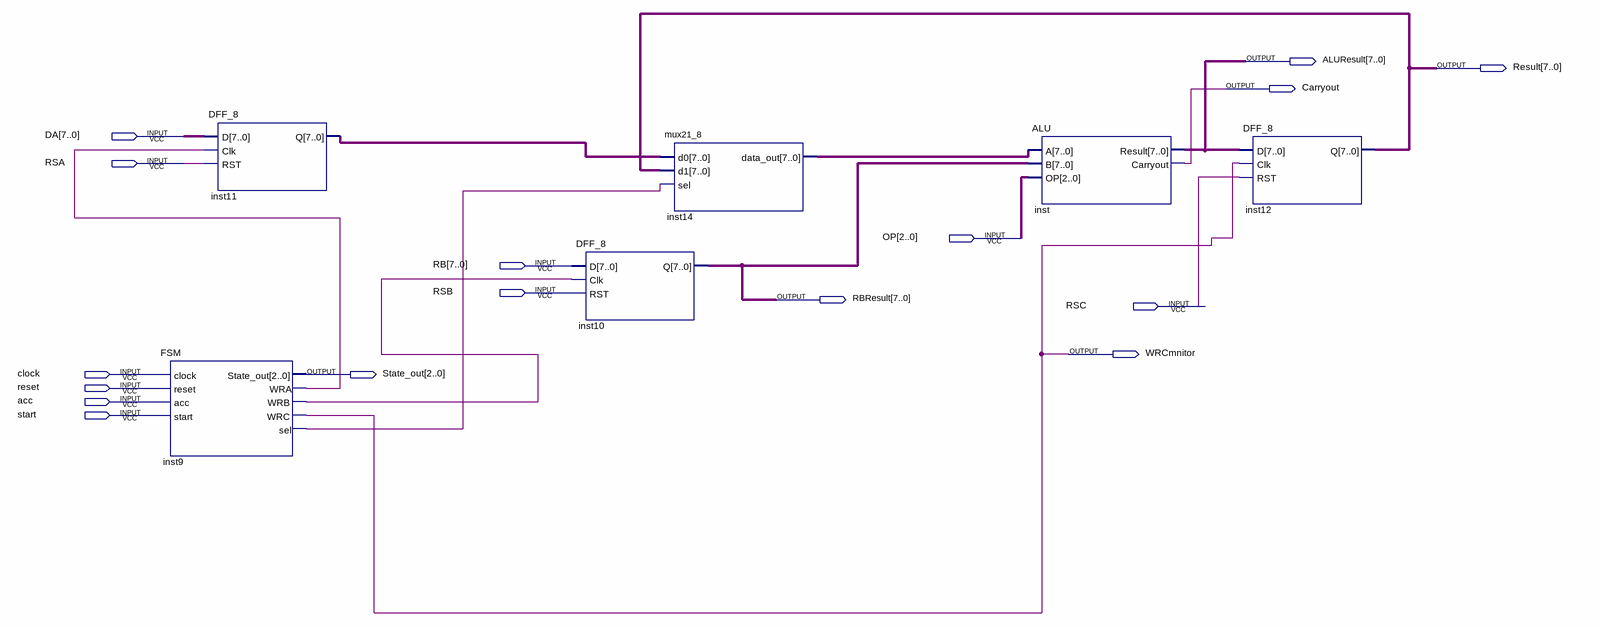
[diagram p0: schematic sheet]
// Quartus schematic ALU_8bit.bdf as structural Verilog: 6 symbols, 16 pins
module ALU_8bit (
  input  [7:0] DA,
  input  RSA,
  input  [2:0] OP,
  input  [7:0] RB,
  input  RSB,
  input  RSC,
  input  clock,
  input  reset,
  input  acc,
  input  start,
  output [7:0] ALUResult,
  output [7:0] Result,
  output Carryout,
  output [7:0] RBResult,
  output WRCmnitor,
  output [2:0] State_out
);

  wire inst9_sel, inst9_wra, inst9_wrb;
  wire [7:0] inst11_q, inst14_data_out;

  FSM inst9 (
    .clock(clock), .reset(reset), .acc(acc), .start(start), .State_out(State_out), .WRA(inst9_wra),
    .WRB(inst9_wrb), .WRC(WRCmnitor), .sel(inst9_sel));
  DFF_8 inst11 (.D(DA), .Clk(inst9_wra), .RST(RSA), .Q(inst11_q));
  DFF_8 inst10 (.D(RB), .Clk(inst9_wrb), .RST(RSB), .Q(RBResult));
  mux21_8 inst14 (.d0(inst11_q), .d1(Result), .sel(inst9_sel), .data_out(inst14_data_out));
  ALU inst (.A(inst14_data_out), .B(RBResult), .OP(OP), .Result(ALUResult), .Carryout(Carryout));
  DFF_8 inst12 (.D(ALUResult), .Clk(WRCmnitor), .RST(RSC), .Q(Result));
endmodule
